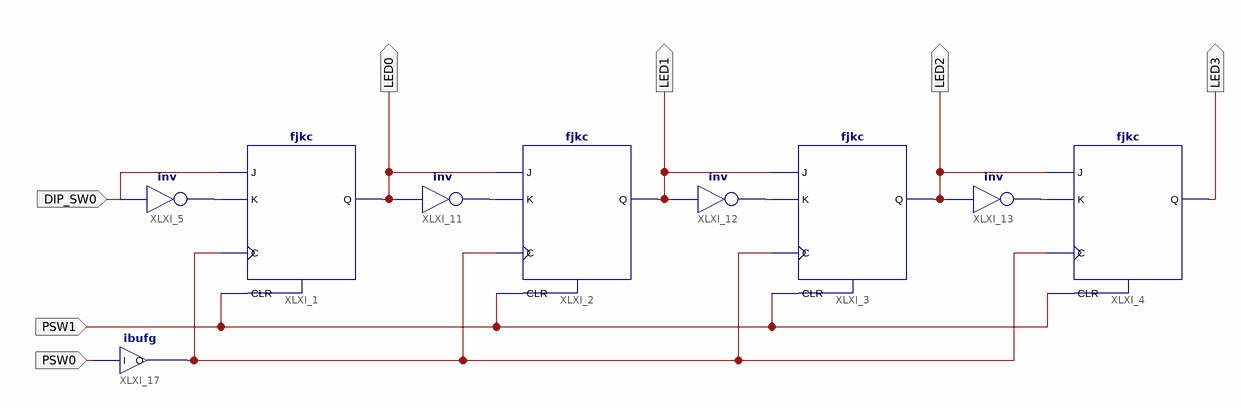
[diagram p0: schematic sheet 1]
// Xilinx ISE schematic lab8_shift.sch (spartan3) as structural Verilog: 9 symbols, 7 ports
module lab8_shift (
  input  DIP_SW0,
  input  PSW1,
  input  PSW0,
  output LED0,
  output LED1,
  output LED2,
  output LED3
);

  wire XLXN_1, XLXN_5, XLXN_9, XLXN_10, XLXN_38;

  fjkc XLXI_1 (.C(XLXN_38), .CLR(PSW1), .J(DIP_SW0), .K(XLXN_1), .Q(LED0));
  not XLXI_5 (XLXN_1, DIP_SW0);
  fjkc XLXI_2 (.C(XLXN_38), .CLR(PSW1), .J(LED0), .K(XLXN_5), .Q(LED1));
  not XLXI_11 (XLXN_5, LED0);
  not XLXI_12 (XLXN_9, LED1);
  fjkc XLXI_3 (.C(XLXN_38), .CLR(PSW1), .J(LED1), .K(XLXN_9), .Q(LED2));
  not XLXI_13 (XLXN_10, LED2);
  fjkc XLXI_4 (.C(XLXN_38), .CLR(PSW1), .J(LED2), .K(XLXN_10), .Q(LED3));
  ibufg XLXI_17 (.I(PSW0), .O(XLXN_38));
endmodule
